# EAGLE schematic main (EAGLE 6.5.0)
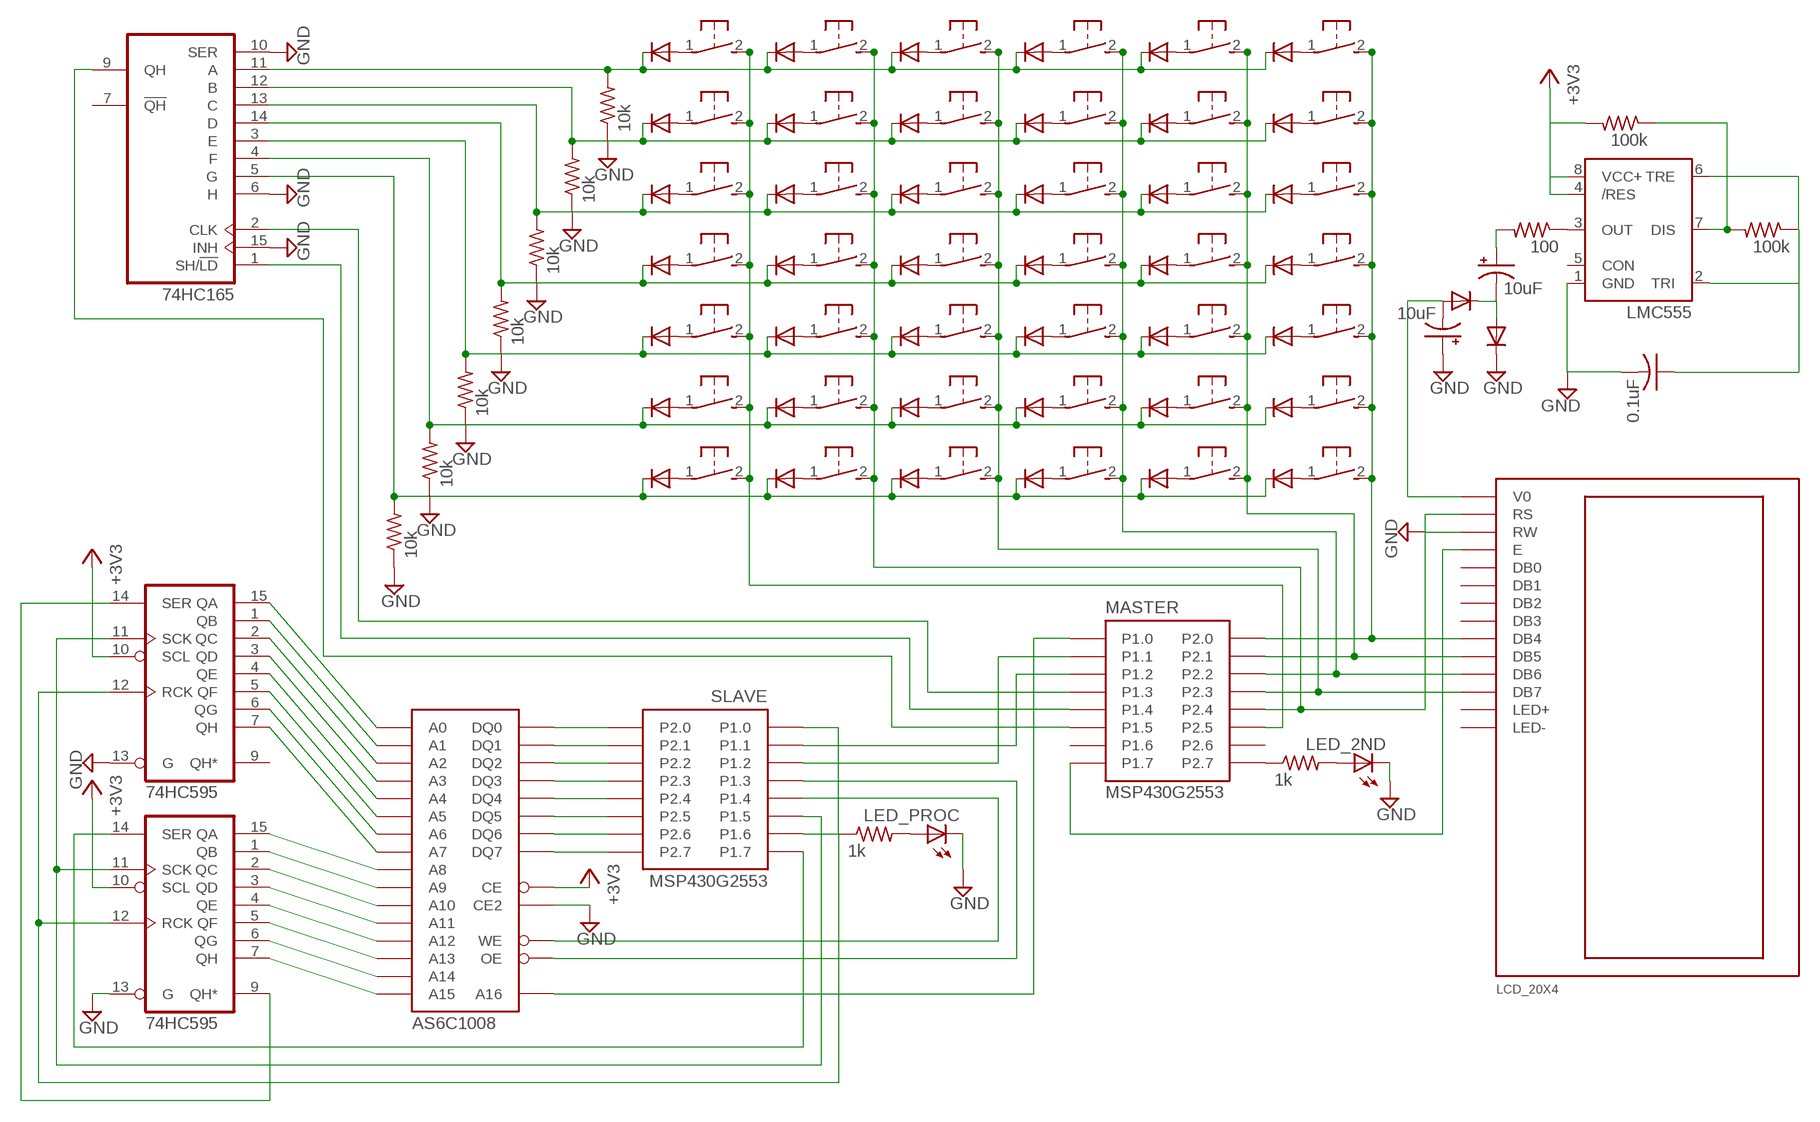
[diagram p0: schematic, sheet 1]

## Parts
C2  0.1uF  C-US025-024X044  [C025-024X044]
C4  10uF  CPOL-US085CS-1AW  [085CS_1AW]
C5  10uF  CPOL-US085CS-1AW  [085CS_1AW]
D1  1N4148DO35-7  [DO35-7]
D2  1N4148DO35-7  [DO35-7]
D3  1N4148DO35-7  [DO35-7]
D4  1N4148DO35-7  [DO35-7]
D5  1N4148DO35-7  [DO35-7]
D6  1N4148DO35-7  [DO35-7]
D7  1N4148DO35-7  [DO35-7]
D8  1N4148DO35-7  [DO35-7]
D9  1N4148DO35-7  [DO35-7]
D10  1N4148DO35-7  [DO35-7]
D11  1N4148DO35-7  [DO35-7]
D12  1N4148DO35-7  [DO35-7]
D13  1N4148DO35-7  [DO35-7]
D14  1N4148DO35-7  [DO35-7]
D15  1N4148DO35-7  [DO35-7]
D16  1N4148DO35-7  [DO35-7]
D17  1N4148DO35-7  [DO35-7]
D18  1N4148DO35-7  [DO35-7]
D19  1N4148DO35-7  [DO35-7]
D20  1N4148DO35-7  [DO35-7]
D21  1N4148DO35-7  [DO35-7]
D22  1N4148DO35-7  [DO35-7]
D23  1N4148DO35-7  [DO35-7]
D24  1N4148DO35-7  [DO35-7]
D25  1N4148DO35-7  [DO35-7]
D26  1N4148DO35-7  [DO35-7]
D27  1N4148DO35-7  [DO35-7]
D28  1N4148DO35-7  [DO35-7]
D29  1N4148DO35-7  [DO35-7]
D30  1N4148DO35-7  [DO35-7]
D31  1N4148DO35-7  [DO35-7]
D32  1N4148DO35-7  [DO35-7]
D33  1N4148DO35-7  [DO35-7]
D34  1N4148DO35-7  [DO35-7]
D35  1N4148DO35-7  [DO35-7]
D36  1N4148DO35-7  [DO35-7]
D37  1N4148DO35-7  [DO35-7]
D38  1N4148DO35-7  [DO35-7]
D39  1N4148DO35-7  [DO35-7]
D40  1N4148DO35-7  [DO35-7]
D41  1N4148DO35-7  [DO35-7]
D42  1N4148DO35-7  [DO35-7]
D45  1N4148DO35-7  [DO35-7]
D46  1N4148DO35-7  [DO35-7]
IC1  74HC165  74165N  [DIL16]
IC2  LMC555  NE555  [DIL-08]
IC3  74HC595  74LS595N  [DIL16]
IC4  74HC595  74LS595N  [DIL16]
LED_2ND  SFH482  [SFH482]
LED_PROC  SFH482  [SFH482]
MASTER  MSP430G2553  [MSP430G2553]
R1  1k  R-US_0204/2V  [0204V]
R2  10k  R-US_0204/2V  [0204V]
R3  10k  R-US_0204/2V  [0204V]
R4  10k  R-US_0204/2V  [0204V]
R5  10k  R-US_0204/2V  [0204V]
R6  10k  R-US_0204/2V  [0204V]
R7  10k  R-US_0204/2V  [0204V]
R8  10k  R-US_0204/2V  [0204V]
R9  100k  R-US_0204/2V  [0204V]
R10  100k  R-US_0204/2V  [0204V]
R11  100  R-US_0204/2V  [0204V]
R12  1k  R-US_0204/2V  [0204V]
S1  31-XX  [B3F-31XX]
S2  31-XX  [B3F-31XX]
S3  31-XX  [B3F-31XX]
S4  31-XX  [B3F-31XX]
S5  31-XX  [B3F-31XX]
S6  31-XX  [B3F-31XX]
S7  31-XX  [B3F-31XX]
S8  31-XX  [B3F-31XX]
S9  31-XX  [B3F-31XX]
S10  31-XX  [B3F-31XX]
S11  31-XX  [B3F-31XX]
S12  31-XX  [B3F-31XX]
S13  31-XX  [B3F-31XX]
S14  31-XX  [B3F-31XX]
S15  31-XX  [B3F-31XX]
S16  31-XX  [B3F-31XX]
S17  31-XX  [B3F-31XX]
S18  31-XX  [B3F-31XX]
S19  31-XX  [B3F-31XX]
S20  31-XX  [B3F-31XX]
S21  31-XX  [B3F-31XX]
S22  31-XX  [B3F-31XX]
S23  31-XX  [B3F-31XX]
S24  31-XX  [B3F-31XX]
S25  31-XX  [B3F-31XX]
S26  31-XX  [B3F-31XX]
S27  31-XX  [B3F-31XX]
S28  31-XX  [B3F-31XX]
S29  31-XX  [B3F-31XX]
S30  31-XX  [B3F-31XX]
S31  31-XX  [B3F-31XX]
S32  31-XX  [B3F-31XX]
S33  31-XX  [B3F-31XX]
S34  31-XX  [B3F-31XX]
S35  31-XX  [B3F-31XX]
S36  31-XX  [B3F-31XX]
S37  31-XX  [B3F-31XX]
S38  31-XX  [B3F-31XX]
S39  31-XX  [B3F-31XX]
S40  31-XX  [B3F-31XX]
S41  31-XX  [B3F-31XX]
S42  31-XX  [B3F-31XX]
SLAVE  MSP430G2553  [MSP430G2553]
U$1  LCD_20X4  [LCD_20X4]
U$2  AS6C1008  [AS6C1008]

## Nets
+3V3: IC2.4(/RES) IC2.8(VCC+) IC3.10(SCL) IC4.10(SCL) R10.2 U$2.P$18(CE)
GND: C2.2 C5.+ D45.C IC1.6(H) IC1.10(SER) IC1.15(INH) IC2.1(GND) IC3.13(G) IC4.13(G) LED_2ND.K(C) LED_PROC.K(C) R2.1 R3.1 R4.1 R5.1 R6.1 R7.1 R8.1 U$1.P$15(RW) U$2.P$19(CE2)
N$1: MASTER.P$16(P2.7) R1.1
N$2: LED_2ND.A R1.2
N$3: MASTER.P$9(P2.0) S6.2(S) S12.2(S) S18.2(S) S24.2(S) S30.2(S) S36.2(S) S38.2(S) U$1.P$5(DB4)
N$4: MASTER.P$10(P2.1) S5.2(S) S11.2(S) S17.2(S) S23.2(S) S29.2(S) S35.2(S) S37.2(S) U$1.P$6(DB5)
N$5: MASTER.P$11(P2.2) S1.2(S) S7.2(S) S13.2(S) S19.2(S) S25.2(S) S31.2(S) S39.2(S) U$1.P$7(DB6)
N$6: MASTER.P$12(P2.3) S2.2(S) S8.2(S) S14.2(S) S20.2(S) S26.2(S) S32.2(S) S40.2(S) U$1.P$8(DB7)
N$7: MASTER.P$8(P1.7) U$1.P$11(E)
N$8: MASTER.P$13(P2.4) S3.2(S) S9.2(S) S15.2(S) S21.2(S) S27.2(S) S33.2(S) S41.2(S) U$1.P$14(RS)
N$9: D2.A S38.1(P)
N$10: D1.A S6.1(P)
N$11: D1.C D3.C D9.C D10.C D11.C D12.C IC1.12(B) R3.2
N$12: D2.C D4.C D5.C D6.C D7.C D8.C IC1.11(A) R2.2
N$13: D5.A S37.1(P)
N$14: D3.A S5.1(P)
N$15: D9.A S7.1(P)
N$16: D10.A S8.1(P)
N$17: D4.A S1.1(P)
N$18: D11.A S9.1(P)
N$19: D6.A S2.1(P)
N$20: D12.A S10.1(P)
N$21: D7.A S3.1(P)
N$22: D13.A S12.1(P)
N$23: D8.A S4.1(P)
N$24: D13.C D14.C D15.C D16.C D17.C D18.C IC1.13(C) R4.2
N$25: D14.A S11.1(P)
N$26: D15.A S13.1(P)
N$27: D16.A S14.1(P)
N$28: D17.A S15.1(P)
N$29: D18.A S16.1(P)
N$30: D19.A S18.1(P)
N$31: D19.C D20.C D21.C D22.C D23.C D24.C IC1.14(D) R5.2
N$32: D20.A S17.1(P)
N$33: D21.A S19.1(P)
N$34: D22.A S20.1(P)
N$35: D23.A S21.1(P)
N$36: D24.A S22.1(P)
N$37: D25.A S24.1(P)
N$38: D25.C D26.C D27.C D28.C D29.C D30.C IC1.3(E) R6.2
N$39: D26.A S23.1(P)
N$40: D27.A S25.1(P)
N$41: D28.A S26.1(P)
N$42: D29.A S27.1(P)
N$43: D30.A S28.1(P)
N$44: D31.A S30.1(P)
N$45: D31.C D32.C D33.C D34.C D35.C D36.C IC1.4(F) R7.2
N$46: D32.A S29.1(P)
N$47: D33.A S31.1(P)
N$48: D34.A S32.1(P)
N$49: D35.A S33.1(P)
N$50: D36.A S34.1(P)
N$51: D37.A S36.1(P)
N$52: D37.C D38.C D39.C D40.C D41.C D42.C IC1.5(G) R8.2
N$53: D38.A S35.1(P)
N$54: D39.A S39.1(P)
N$55: D40.A S40.1(P)
N$56: D41.A S41.1(P)
N$57: D42.A S42.1(P)
N$58: IC1.2(CLK) MASTER.P$4(P1.3)
N$59: IC1.1(SH/!LD) MASTER.P$5(P1.4)
N$60: IC1.9(QH) MASTER.P$6(P1.5)
N$61: IC2.7(DIS) R9.2 R10.1
N$62: MASTER.P$1(P1.0) U$2.P$17(A16)
N$63: C2.1 IC2.2(TRI) IC2.6(TRE) R9.1
N$64: MASTER.P$14(P2.5) S4.2(S) S10.2(S) S16.2(S) S22.2(S) S28.2(S) S34.2(S) S42.2(S)
N$65: IC2.3(OUT) R11.1
N$66: C4.+ R11.2
N$67: MASTER.P$3(P1.2) SLAVE.P$2(P1.1)
N$68: C4.- D45.A D46.C
N$69: C5.- D46.A U$1.P$16(V0)
N$70: MASTER.P$2(P1.1) SLAVE.P$3(P1.2)
N$71: SLAVE.P$9(P2.0) U$2.P$20(DQ0)
N$72: SLAVE.P$10(P2.1) U$2.P$21(DQ1)
N$73: SLAVE.P$11(P2.2) U$2.P$22(DQ2)
N$74: SLAVE.P$12(P2.3) U$2.P$23(DQ3)
N$75: SLAVE.P$13(P2.4) U$2.P$24(DQ4)
N$76: SLAVE.P$14(P2.5) U$2.P$25(DQ5)
N$77: SLAVE.P$15(P2.6) U$2.P$26(DQ6)
N$78: SLAVE.P$16(P2.7) U$2.P$27(DQ7)
N$79: SLAVE.P$4(P1.3) U$2.P$28(OE)
N$80: SLAVE.P$5(P1.4) U$2.P$29(WE)
N$81: IC3.12(RCK) IC4.12(RCK) R12.1 SLAVE.P$1(P1.0) SLAVE.P$7(P1.6)
N$82: IC3.11(SCK) IC4.11(SCK) SLAVE.P$6(P1.5)
N$83: IC4.14(SER) SLAVE.P$8(P1.7)
N$84: LED_PROC.A R12.2
N$85: IC3.14(SER) IC4.9(QH*)
N$86: IC3.15(QA) U$2.P$1(A0)
N$87: IC3.1(QB) U$2.P$2(A1)
N$88: IC3.2(QC) U$2.P$3(A2)
N$89: IC3.3(QD) U$2.P$4(A3)
N$90: IC3.4(QE) U$2.P$5(A4)
N$91: IC3.5(QF) U$2.P$6(A5)
N$92: IC3.6(QG) U$2.P$7(A6)
N$93: IC3.7(QH) U$2.P$8(A7)
N$94: IC4.15(QA) U$2.P$9(A8)
N$95: IC4.1(QB) U$2.P$10(A9)
N$96: IC4.2(QC) U$2.P$11(A10)
N$97: IC4.3(QD) U$2.P$12(A11)
N$98: IC4.4(QE) U$2.P$13(A12)
N$99: IC4.5(QF) U$2.P$14(A13)
N$100: IC4.6(QG) U$2.P$15(A14)
N$101: IC4.7(QH) U$2.P$16(A15)
Unconnected: IC1.7(!QH) IC2.5(CON) IC3.9(QH*) MASTER.P$7(P1.6) MASTER.P$15(P2.6) U$1.P$1(DB0) U$1.P$2(DB1) U$1.P$3(DB2) U$1.P$4(DB3) U$1.P$12(LED+) U$1.P$13(LED-)

## Power pins joined to a net without a drawn wire
GND: IC1.8(GND) IC3.8(GND) IC4.8(GND)
VCC: IC1.16(VCC) IC3.16(VCC) IC4.16(VCC)

## Library data of the parts
C2 = rcl:C-US: CAPACITOR, American symbol
C4 C5 = rcl:CPOL-US: POLARIZED CAPACITOR, American symbol
D1-D42 D45 D46 = diode:1N4148: DIODE high speed (Philips)
IC1 = 74xx-us:74*165: 8-bit parallel load SHIFT REGISTER
IC2 = st-microelectronics:NE555: General purpose bipolar Timer; MF: Arrow Electronics; MPN: NE555N; OC_FARNELL: 1467742; OC_NEWARK: 89K1486
IC3 IC4 = 74xx-us:74*595: 8-bit SHIFT REGISTER, output latch
LED_2ND LED_PROC = led:SFH482: IR LED infrared emitting diode, Infineon
MASTER SLAVE = MSP430G2553:MSP430G2553
R1-R12 = rcl:R-US_: RESISTOR, American symbol
S1-S42 = switch-omron:31-XX: OMRON SWITCH; MPN: B3F-3100; OC_FARNELL: 959704; OC_NEWARK: 36M3582
U$1 = LCD_20x4:LCD_20X4
U$2 = AS6C1008:AS6C1008